# Altium schematic sheet SoundChip-ProtoHeader.SchDoc
size A
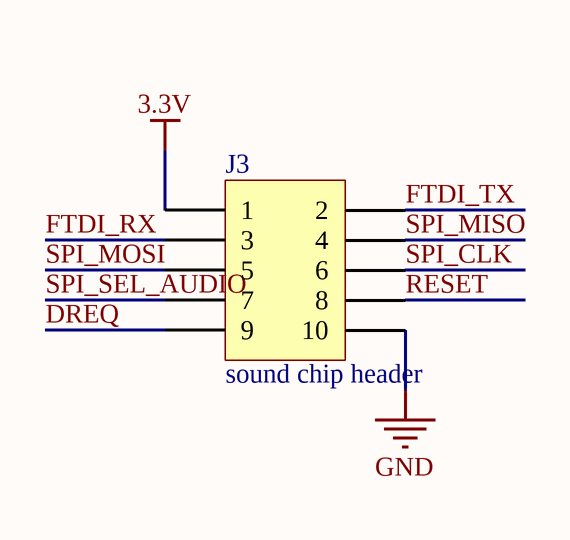
[diagram p0: SoundChip-ProtoHeader.SchDoc]

## Parts
J3  sound chip header  [HDR2X5]

## Nets
3.3V: J3.1
GND: J3.10
DREQ: J3.9
FTDI_RX: J3.3
FTDI_TX: J3.2
RESET: J3.8
SPI_CLK: J3.6
SPI_MISO: J3.4
SPI_MOSI: J3.5
SPI_SEL_AUDIO: J3.7

## Library data of the parts
J3 = Header 5X2: Header, 5-Pin, Dual row; LatestRevisionDate: 17-Jul-2002; LatestRevisionNote: Re-released for DXP Platform.; Publisher: Altium Limited